# Altium schematic sheet 7_sample_hold_wallfilter.SchDoc
size A; SheetNumber: 7; SheetTotal: 8
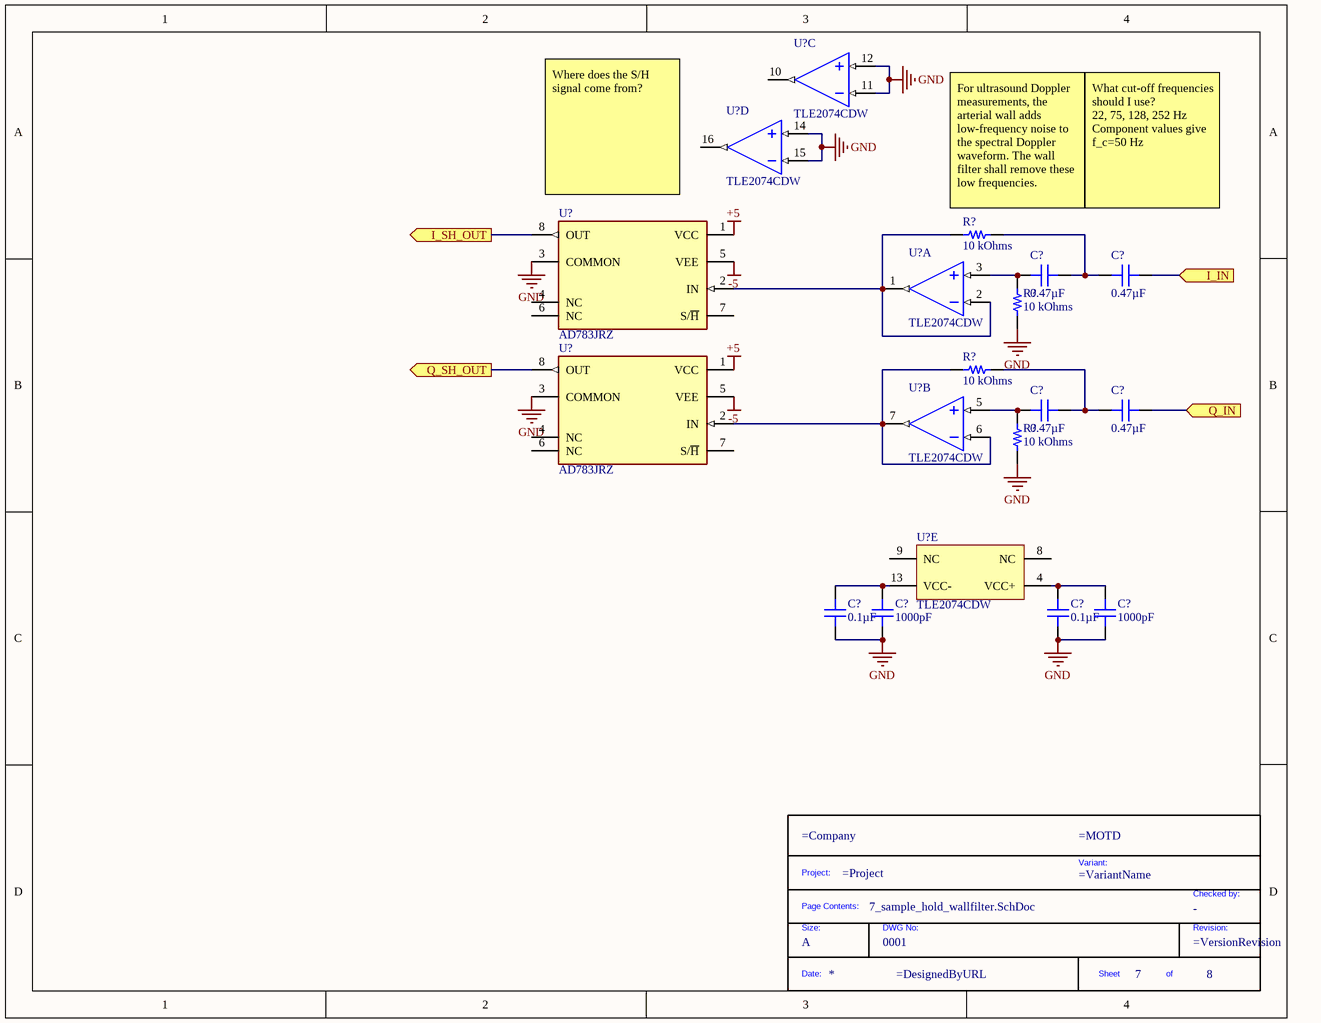
[diagram p0: 7_sample_hold_wallfilter.SchDoc]

## Parts
(Parts that share a designator on the sheet are numbered #1, #2 ... from top to bottom, then left to right.)
*?  DWG No: 0001  Size: A  (hidden comment: TitleBlock)  (graphical)
C?#1  0.47µF  [CAP 1206_3216 - 1.8MM]
C?#2  0.47µF  [CAP 1206_3216 - 1.8MM]
C?#3  0.47µF  [CAP 1206_3216 - 1.8MM]
C?#4  0.47µF  [CAP 1206_3216 - 1.8MM]
C?#5  0.1µF  [CAP 1206_3216 - 1.0MM]
C?#6  1000pF  [CAP 1206_3216 - 1.2MM]
C?#7  0.1µF  [CAP 1206_3216 - 1.0MM]
C?#8  1000pF  [CAP 1206_3216 - 1.2MM]
R?#1  10 kOhms  [RES 1206_3216]
R?#2  10 kOhms  [RES 1206_3216]
R?#3  10 kOhms  [RES 1206_3216]
R?#4  10 kOhms  [RES 1206_3216]
U?#1  TLE2074CDW  [DW0016A_M]  (part C of 5)
U?#2  TLE2074CDW  [DW0016A_M]  (part D of 5)
U?#3  AD783JRZ  [FP-R-8-IPC_B]
U?#4  TLE2074CDW  [DW0016A_M]  (part A of 5)
U?#5  AD783JRZ  [FP-R-8-IPC_B]
U?#6  TLE2074CDW  [DW0016A_M]  (part B of 5)
U?#7  TLE2074CDW  [DW0016A_M]  (part E of 5)

## Ports
I_IN (in), I_SH_OUT (out), Q_IN (in), Q_SH_OUT (out)

## Nets
+5: U?#3.1(VCC) U?#5.1(VCC)
-5: U?#3.5(VEE) U?#5.5(VEE)
GND: C?#5.1 C?#6.1 C?#7.1 C?#8.1 R?#2.1 R?#4.1 U?#1.11(IN3-) U?#1.12(IN3+) U?#2.14(IN4+) U?#2.15(IN4-) U?#3.3(COMMON) U?#5.3(COMMON)
I_IN: C?#2.1 ; port I_IN
I_SH_OUT: U?#3.8(OUT) ; port I_SH_OUT
Q_IN: C?#4.1 ; port Q_IN
Q_SH_OUT: U?#5.8(OUT) ; port Q_SH_OUT
NetC?#1_1: C?#1.1 C?#2.2 R?#1.2
NetC?#1_2: C?#1.2 R?#2.2 U?#4.3(IN1+)
NetC?#3_1: C?#3.1 C?#4.2 R?#3.2
NetC?#3_2: C?#3.2 R?#4.2 U?#6.5(IN2+)
NetC?#5_2: C?#5.2 C?#6.2 U?#7.13(VCC-)
NetC?#7_2: C?#7.2 C?#8.2 U?#7.4(VCC+)
NetR?#1_1: R?#1.1 U?#3.2(IN) U?#4.1(OUT1) U?#4.2(IN1-)
NetR?#3_1: R?#3.1 U?#5.2(IN) U?#6.6(IN2-) U?#6.7(OUT2)

Not connected (* = marked no-connect by the designer): U?#1 10(OUT3); U?#2 16(OUT4); U?#3 4(NC) 6(NC) 7(S/~{H}); U?#5 4(NC) 6(NC) 7(S/~{H}); U?#7 8(NC) 9(NC)

## Notes on the sheet
- (near U?#3) Where does the S/H signal come from?
- (near R?#1) For ultrasound Doppler measurements, the arterial wall adds low-frequency noise to the spectral Doppler waveform. The wall filter shall remove these low frequencies.
- What cut-off frequencies should I use?
  22, 75, 128, 252 Hz
  Component values give f_c=50 Hz
- (in symbol TitleBlock) Project:; Variant:; Checked by:; Page Contents:; Size:; DWG No:; Revision:; Date:; Sheet; of

## Library data of the parts
*? = TitleBlock: Standard Title Block; Checked by: -
C?#1-C?#4 = 12065C474JAT2A: CAP CER 0.47UF 50V X7R 1206; manufacturer: AVX Corporation; Tolerance: ±5%; Part Number: 12065C474JAT2A; Value: 0.47µF; Applications: General Purpose; Capacitance: 0.47µF; componentlink1description: Datasheet; componentlink1url: http://datasheets.avx.com/X7RDielectric.pdf; componentlink2description: DigiKey Link; componentlink2url: http://digikey.com/product-detail/en/avx-corporation/12065C474JAT2A/478-5784-1-ND/2136376; Device Package: 1206 (3216 Metric); lastupdated: 2020-09-02 01:05:40; Lifecycle Status: Active; Minimum Order: 1; Mounting Type: Surface Mount, MLCC; Operating Temperature: -55°C ~ 125°C; Package / Case: 1206 (3216 Metric); packaging: TapeAndReel; partid: 20070; Part Status: Active; price: 0.08; series: -; Size / Dimension: 0.126" L x 0.063" W (3.20mm x 1.60mm); Supplier 1: DigiKey; Supplier Part Number 1: 478-5784-1-ND; Temperature Coefficient: X7R; Thickness (Max): 0.060" (1.52mm); Voltage - Rated: 50V
C?#5 C?#7 = 12065C104JAT2A: CAP CER 0.1UF 50V X7R 1206; manufacturer: AVX Corporation; Tolerance: ±5%; Part Number: 12065C104JAT2A; Value: 0.1µF; Applications: General Purpose; Capacitance: 0.1µF; componentlink1description: Datasheet; componentlink1url: http://datasheets.avx.com/X7RDielectric.pdf; componentlink2description: DigiKey Link; componentlink2url: http://digikey.com/product-detail/en/avx-corporation/12065C104JAT2A/478-3797-1-ND/1116495; Device Package: 1206 (3216 Metric); lastupdated: 2020-09-02 01:05:06; Lifecycle Status: Active; Minimum Order: 1; Mounting Type: Surface Mount, MLCC; Operating Temperature: -55°C ~ 125°C; Package / Case: 1206 (3216 Metric); packaging: TapeAndReel; partid: 19088; Part Status: Active; price: 0.06; series: -; Size / Dimension: 0.126" L x 0.063" W (3.20mm x 1.60mm); Supplier 1: DigiKey; Supplier Part Number 1: 478-3797-1-ND; Temperature Coefficient: X7R; Thickness (Max): 0.037" (0.94mm); Voltage - Rated: 50V
C?#6 C?#8 = 12067C102KAT2A: CAP CER 1000PF 500V X7R 1206; manufacturer: AVX Corporation; Tolerance: ±10%; Part Number: 12067C102KAT2A; Value: 1000pF; Applications: General Purpose; Capacitance: 1000pF; componentlink1description: Datasheet; componentlink1url: http://datasheets.avx.com/X7RDielectric.pdf; componentlink2description: DigiKey Link; componentlink2url: http://digikey.com/product-detail/en/avx-corporation/12067C102KAT2A/478-3805-1-ND/1116503; Device Package: 1206 (3216 Metric); lastupdated: 2020-09-02 01:05:09; Lifecycle Status: Active; Minimum Order: 1; Mounting Type: Surface Mount, MLCC; Operating Temperature: -55°C ~ 125°C; Package / Case: 1206 (3216 Metric); packaging: TapeAndReel; partid: 19161; Part Status: Active; price: 0.09; series: -; Size / Dimension: 0.126" L x 0.063" W (3.20mm x 1.60mm); Supplier 1: DigiKey; Supplier Part Number 1: 478-3805-1-ND; Temperature Coefficient: X7R; Thickness (Max): 0.040" (1.02mm); Voltage - Rated: 500V
R?#1-R?#4 = ESR18EZPF1002: RES SMD 10K OHM 1% 1/2W 1206; Manufacturer: Rohm Semiconductor; Power (Watts): 0.5W, 1/2W; Temperature Coefficient: ±100ppm/°C; Part Number: ESR18EZPF1002; ComponentLink1Description: Datasheet; ComponentLink1URL: https://www.rohm.com/datasheet/ESR01MZPF/esr-e; ComponentLink2Description: DigiKey Link; ComponentLink2URL: https://www.digikey.com/en/products/detail/rohm-semiconductor/ESR18EZPF1002/1983592; Composition: Thick Film; Device Package: 1206 (3216 Metric); Features: Automotive AEC-Q200, Pulse Withstanding; Height - Seated (Max): 0.026" (0.65mm); LastUpdated: 2022-09-19 13:29:57; Lifecycle Status: Active; Minimum Order: 1; Number of Terminations: 2; Operating Temperature: -55°C ~ 155°C; Package / Case: 1206 (3216 Metric); Packaging: TapeAndReel; PartId: 26965; Part Status: Active; Price: 0.02; Ratings: AEC-Q200; Resistance: 10 kOhms; Series: ESR; Size / Dimension: 0.126" L x 0.063" W (3.20mm x 1.60mm); Supplier 1: DigiKey; Supplier Part Number 1: RHM10.0KAFCT-ND; Supplier Device Package: 1206; Tolerance: ±1%; Value: 10 kOhms
U?#1 U?#2 U?#4 U?#6 U?#7 = CMP-0272-03500-3: Quad Low-Noise High-Speed JFET-Input Operational Amplifier, 4.5 to 38 V, 0 to 70 degC, 16-pin SOIC (DW16), Green (RoHS & no Sb/Br); Manufacturer: Texas Instruments; GBW(Typ)(MHz): 9.4; Number of Channels: 4; Total Supply Voltage(Min)(+5V is 5, +/-5V is 10): 4.5; Slew Rate(Typ)(V/us): 35; Sub Family: High Output Current Amplifier (>=50mA), High Supply Voltage Amplifier (>=30V), Precision Amplifier; IIB(Max)(pA): 175; Vio (25C)(Max)(mV): 5; Iq per channel(Max)(mA): 1.875; Offset Drift(Typ)(uV/C): 10.1; CMRR(Min)(dB): 70; Total Supply Voltage(Max)(+5V is 5, +/-5V is 10): 38; Packing: TUBE; Rating: Catalog; PartNumber: TLE2074CDW; ComponentLink3URL: http://www.ti.com/litv/pdf/msoi003g; Eco-Plan: Green (RoHS & no Sb/Br); PackageDescription: 16-Pin Plastic Small Outline, Body 10.30 x 7.50 mm, Pitch 1.27 mm; Mounting Technology: Surface Mount; Code_JEDEC: MS-013; ComponentLink2URL: http://www.ti.com/lit/ds/symlink/tle2074.pdf; PackageVersion: 4040000-2/G, 01/2011; PackageReference: DW0016A; ComponentLink1URL: http://www.ti.com/; ComponentLink3Description: Package Specification; DatasheetVersion: SLOS181C; ComponentLink1Description: Manufacturer URL; ComponentLink2Description: Datasheet
U?#3 U?#5 = CMP-09116-000396-1: IC SAMPL/HOLD 1 CIRCUIT 8SOIC; Operating Supply Current: 9.5mA; Settling Time: 150ns; Dual Supply Voltage: 5V; Input Offset Voltage (Vos): 50mV; Number of Circuits: 1; -3db Bandwidth: 15MHz; Output Current per Channel: 5mA; Max Supply Voltage: 5.25V; Input Bias Current: 100nA; Min Supply Voltage: 4.75V; RoHS Compliant: Yes; Max Operating Temperature: 70°C; Mount: Surface Mount; REACH SVHC: No SVHC; Min Operating Temperature: 0°C; Case/Package: SOIC; Number of Amplifiers: 1; Height: 2.45mm; Contact Plating: Tin; Bandwidth: 15MHz; Lead Free: Contains Lead; Number of Pins: 8; Width: 4.01mm; Number of Channels: 1; Length: 5mm; Package Quantity: 1; Series: -; Max Dual Supply Voltage: 5.25V; Min Dual Supply Voltage: 4.75V; Operating Supply Voltage: 5V; Packaging: Rail/Tube